# EasyEDA Pro project 305-Analogue-Stochastic-Signal-Generators.eprj

# Board PCB2
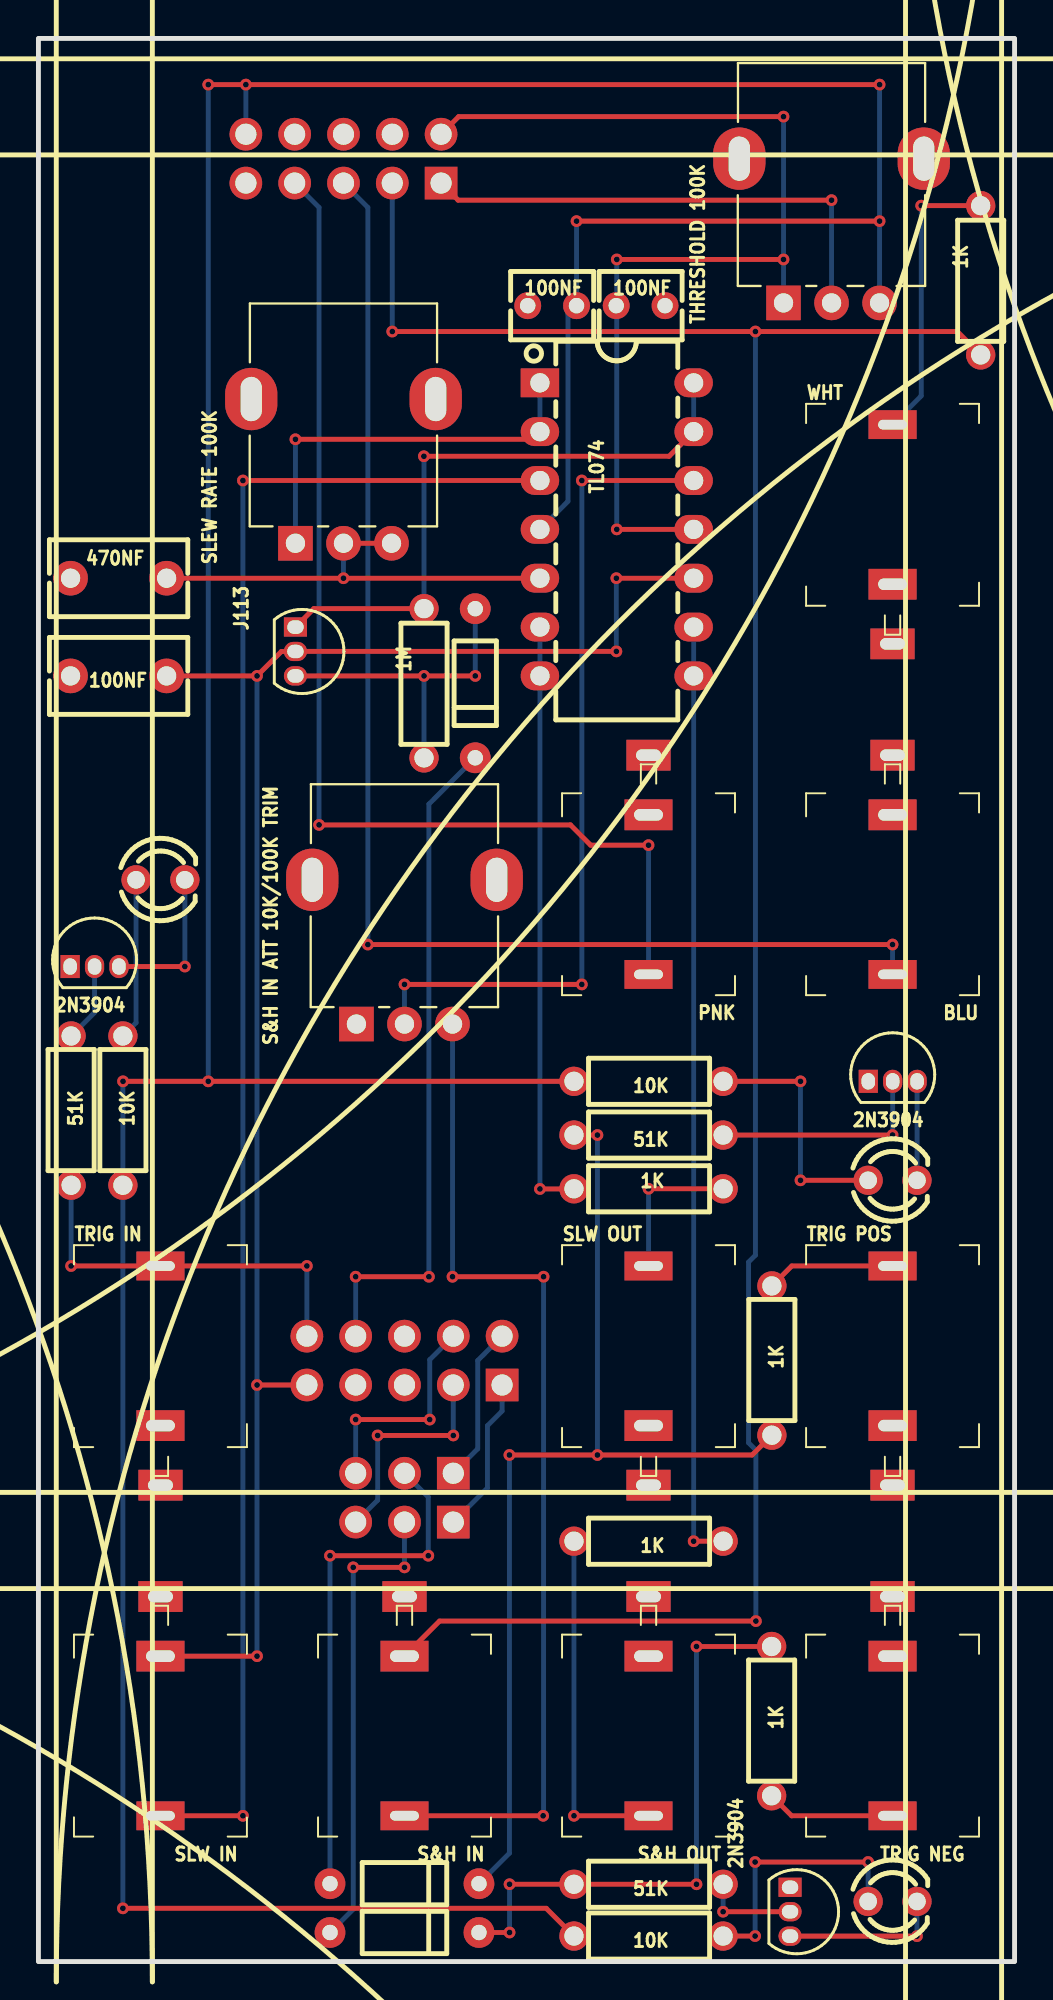
[diagram p0: board, top side]
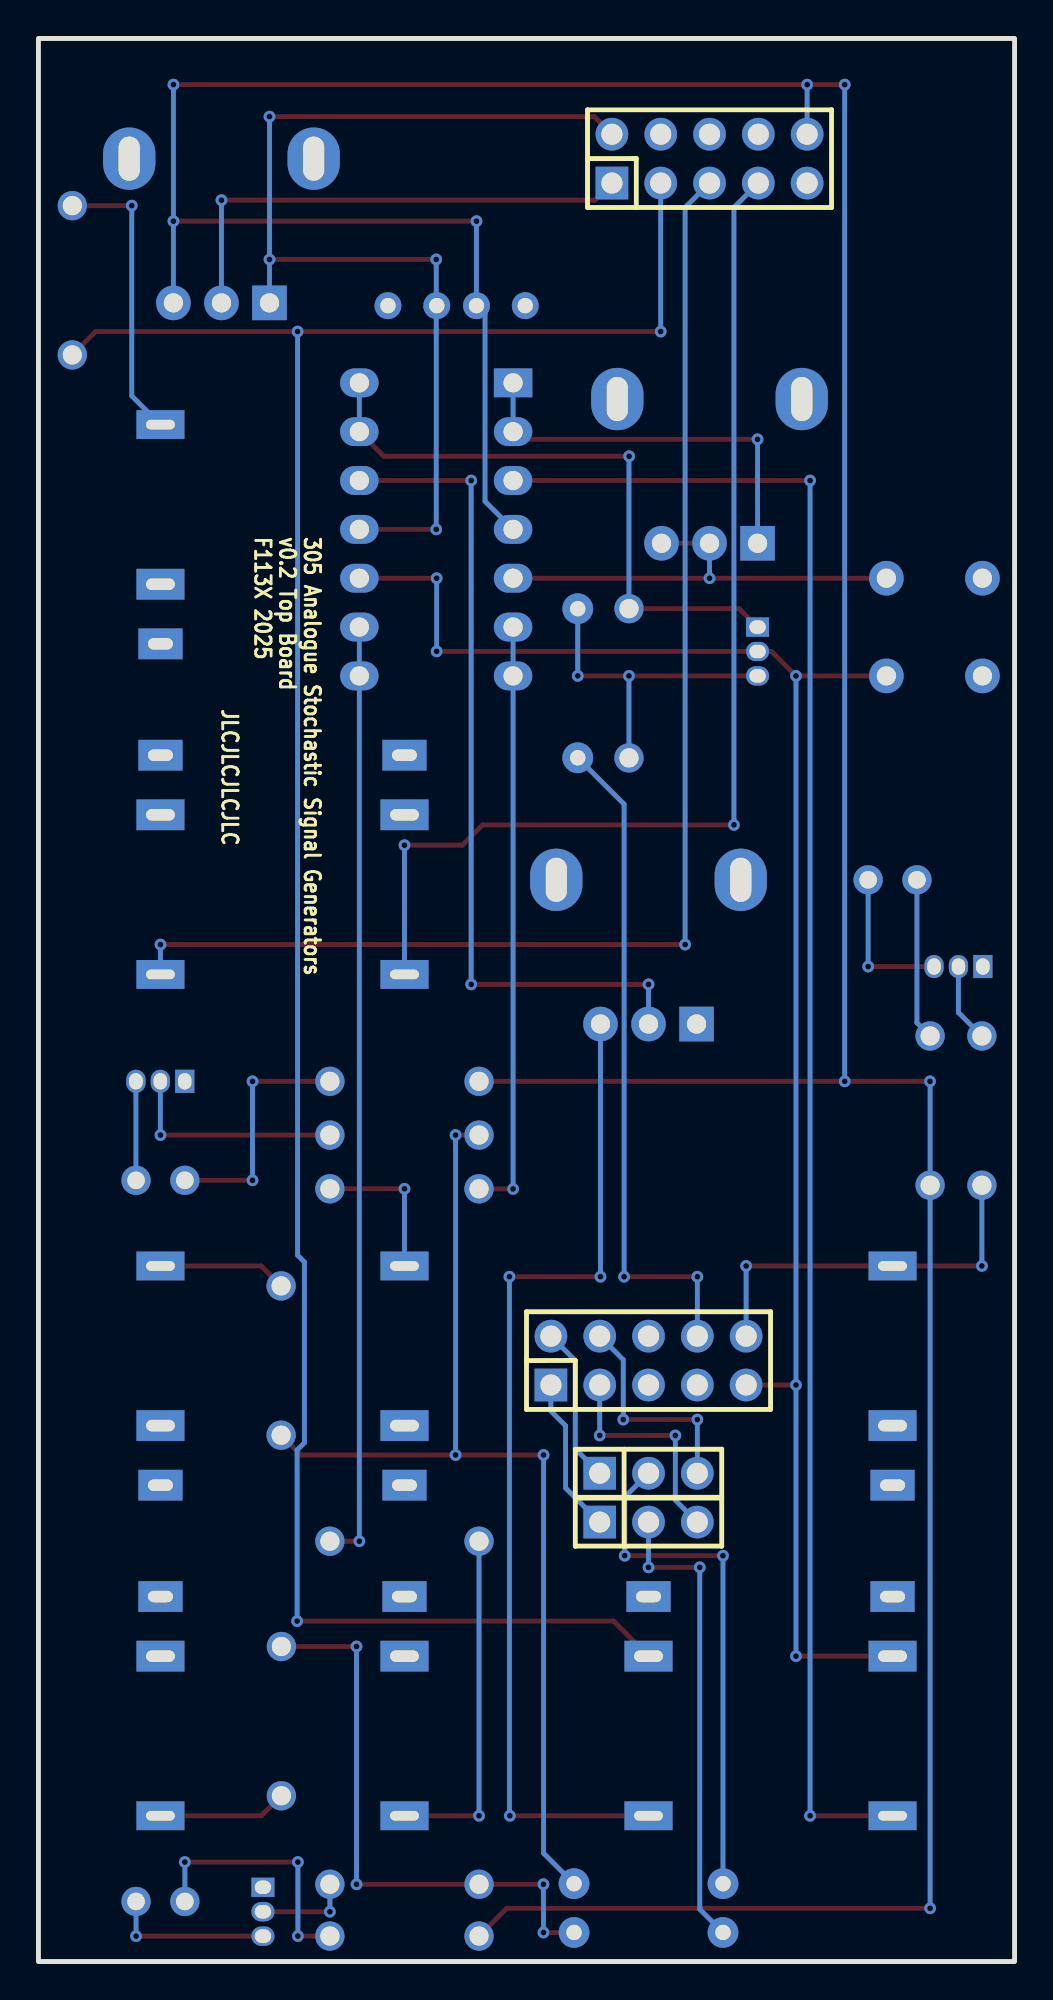
[diagram p1: board, bottom side, seen from below]

Outline 50.8 x 100 mm; copper layers: Top Layer, Bottom Layer. Coordinates in mm from the lower left corner of the outline.
Outline path: rectangle 0,100 50.8,0
Stack: Top Layer 0.035mm / Dielectric1 1.51mm FR4 er 4.5 / Bottom Layer 0.035mm

## Design rules (mm)
template: JLCPCB Capability(Two Layers Board)
spacing copperThickness1oz (default): track to track 0.102, other pairs 0.152 to 0.3
spacing copperThickness2oz: track to track 0.203, other pairs 0.152 to 0.3
track width copperThickness1oz (default): min 0.127, default 0.254, max 2.54
track width copperThickness2oz: min 0.203, default 0.254, max 2.54
differential pair differentialPair (default): width min 0.127, default 0.254, max 2.54; gap min 0.152, default 0.152
via viaSize (default): diameter min 0.5, default 0.61, max 10; hole min 0.3, default 0.305, max 6.3

## Placement (name value [footprint] x y rotation side)
1K  -  [Resistor_Small]  38.16 12.5 90 top
1K#2  -  [Resistor_Small]  49.04 87.43 270 top
1K#3  -  [Resistor_Small]  31.75 21.86 0 top
1K#4  -  [Resistor_Small]  38.17 31.25 90 top
1K#5  -  [Resistor_Small]  31.75 40.18 0 top
1M  -  [Resistor_Small]  20.07 66.47 270 top
2N3904  -  [TO-92-3_L4.5-W3.5-P1.27-L]  39.12 2.59 270 top
2N3904#2  -  [TO-92-3_L4.5-W3.5-P1.27-L]  2.92 51.74 0 top
2N3904#3  -  [TO-92-3_L4.5-W3.5-P1.27-L]  44.46 45.77 0 top
10K  -  [Resistor_Small]  31.75 1.32 0 top
10K#2  -  [Resistor_Small]  31.75 45.77 0 top
10K#3  -  [Resistor_Small]  4.39 44.25 90 top
51K  -  [Resistor_Small]  1.7 44.25 90 top
51K#2  -  [Resistor_Small]  31.75 4.02 0 top
51K#3  -  [Resistor_Small]  31.75 42.98 0 top
100NF  -  [CAP-TH_L4.2-W3.5-P2.54-D0.5]  26.73 86.11 0 top
100NF#2  -  [CAP-TH_L4.2-W3.5-P2.54-D0.5]  31.34 86.11 0 top
100NF#3  -  [CAP-TH_L7.2-W4.0-P5.00-D0.5]  4.17 66.85 0 top
470NF  47nF  [CAP-TH_L7.2-W4.0-P5.00-D0.5]  4.17 71.93 0 top
BLU  -  [Connector_Audio_QingPu:Jack_3.5mm_QingPu_WQP-PJ301M-12]  44.45 56.25 180 top
D1  -  [DO-35_BD2.0-L4.2-P8.20-D0.5-RD]  19.05 1.51 180 top
D1#2  -  [DO-35_BD2.0-L4.2-P8.20-D0.5-RD]  19.05 4.05 180 top
D1#3  -  [DO-35_BD2.0-L4.2-P8.20-D0.5-RD]  22.73 66.47 90 top
H1  -  [HDR-TH_3P-P2.54-V-M]  19.05 25.39 180 bottom
H2  -  [HDR-TH_3P-P2.54-V-M]  19.05 22.85 180 bottom
J113  BC558  [TO-92-3_L4.5-W3.5-P1.27-L]  13.38 68.12 270 top
LED1  -  [LED-TH_BD3.0-P2.54-FD]  44.45 40.62 0 top
LED1#2  -  [LED-TH_BD3.0-P2.54-FD]  44.45 3.12 0 top
LED1#3  -  [LED-TH_BD3.0-P2.54-FD]  6.35 56.25 0 top
PNK  -  [Connector_Audio_QingPu:Jack_3.5mm_QingPu_WQP-PJ301M-12]  31.75 56.25 180 top
S&H IN  -  [Connector_Audio_QingPu:Jack_3.5mm_QingPu_WQP-PJ301M-12]  19.05 12.5 180 top
S&H IN ATT 10K/100K TRIM  -  [benjiaomodular:Potentiometer_RV09]  16.55 48.75 90 top
S&H OUT  -  [Connector_Audio_QingPu:Jack_3.5mm_QingPu_WQP-PJ301M-12]  31.75 12.5 180 top
SLEW RATE 100K  -  [benjiaomodular:Potentiometer_RV09]  13.38 73.75 90 top
SLW IN  -  [Connector_Audio_QingPu:Jack_3.5mm_QingPu_WQP-PJ301M-12]  6.35 12.5 180 top
SLW OUT  -  [Connector_Audio_QingPu:Jack_3.5mm_QingPu_WQP-PJ301M-12]  31.75 31.25 0 top
THRESHOLD 100K  -  [benjiaomodular:Potentiometer_RV09]  38.78 86.25 90 top
TL074  TL074CN  [PDIP-14_L19.7-W6.6-P2.54-LS8.3-BL]  30.1 74.47 270 top
TRIG IN  -  [Connector_Audio_QingPu:Jack_3.5mm_QingPu_WQP-PJ301M-12]  6.35 31.25 0 top
TRIG NEG  -  [Connector_Audio_QingPu:Jack_3.5mm_QingPu_WQP-PJ301M-12]  44.45 12.5 180 top
TRIG POS  -  [Connector_Audio_QingPu:Jack_3.5mm_QingPu_WQP-PJ301M-12]  44.45 31.25 0 top
U1  -  [HDR-TH_10P-P2.54-V-M-R2-C5-S2.54]  19.05 31.25 180 bottom
U1#2  -  [HDR-TH_10P-P2.54-V-M-R2-C5-S2.54]  15.88 93.75 180 bottom
WHT  -  [Connector_Audio_QingPu:Jack_3.5mm_QingPu_WQP-PJ301M-12]  44.45 75 0 top

## Footprints (pads in the part's own frame, mm; a bottom-side part is the same pattern mirrored in y, then rotated)
benjiaomodular:Potentiometer_RV09
  rect 1.8x1.8 hole 1: 1(0,0)
  round 1.8 hole 1: 2(0,-2.5) 3(0,-5)
  oval 3.24x2.72 hole 2.3x1.1: 4(7.5,-7.3) 5(7.5,2.3)
CAP-TH_L4.2-W3.5-P2.54-D0.5
  round 1.4 hole 0.8: 1(-1.27,0) 2(1.27,0)
CAP-TH_L7.2-W4.0-P5.00-D0.5
  round 1.8 hole 1: 1(-2.499,0) 2(2.499,0)
Connector_Audio_QingPu:Jack_3.5mm_QingPu_WQP-PJ301M-12
  rect 2.3x1.6 hole 1.3x0.6: S(0,-6.48)
  rect 2.5x1.5 hole 1.5x0.5: T(0,4.92)
  rect 2.5x1.6 hole 1.5x0.6: TN(0,-3.38)
DO-35_BD2.0-L4.2-P8.20-D0.5-RD
  round 1.6 hole 0.8: 1(-3.876,0) 2(3.876,0)
HDR-TH_3P-P2.54-V-M
  rect 1.7x1.7 hole 1.1: 1(-2.54,0)
  round 1.7 hole 1.1: 2(0,0) 3(2.54,0)
HDR-TH_10P-P2.54-V-M-R2-C5-S2.54
  rect 1.7x1.7 hole 1.1: 1(-5.08,-1.27)
  round 1.7 hole 1.1: 2(-5.08,1.27) 3(-2.54,-1.27) 4(-2.54,1.27) 5(0,-1.27) 6(0,1.27) 7(2.54,-1.27) 8(2.54,1.27) 9(5.08,-1.27) 10(5.08,1.27)
LED-TH_BD3.0-P2.54-FD
  round 1.524 hole 0.914: 1(-1.27,0) 2(1.27,0)
PDIP-14_L19.7-W6.6-P2.54-LS8.3-BL
  rect 1.5x2 hole 1: 1(-7.62,-4)
  oval 1.5x2 hole 1: 2(-5.08,-4) 3(-2.54,-4) 4(0,-4) 5(2.54,-4) 6(5.08,-4) 7(7.62,-4) 8(7.62,4) 9(5.08,4) 10(2.54,4) 11(0,4) 12(-2.54,4) 13(-5.08,4) 14(-7.62,4)
Resistor_Small
  round 1.524 hole 1: 1(-3.88,0) 2(3.882,0)
TO-92-3_L4.5-W3.5-P1.27-L
  rect 1x1.2 hole 0.7x0.85: 1(-1.27,0)
  oval 1x1.2 hole 0.7x0.85: 2(0,0) 3(1.27,0)

## Nets
GND: 2N3904.1 2N3904#2.1 2N3904#3.1 100NF.1 100NF#2.2 100NF#3.1 470NF.1 BLU.S PNK.S S&H IN.S S&H IN ATT 10K/100K TRIM.1 S&H OUT.S SLW IN.S SLW OUT.S TRIG IN.S TRIG NEG.S TRIG POS.S U1.5 U1.6 U1.7 U1#2.4 U1#2.6 U1#2.8 U1#2.9 WHT.S
+12: 10K.1 10K#2.1 10K#3.1 100NF.2 THRESHOLD 100K.3 TL074.4 U1#2.10
-12: 100NF#2.1 THRESHOLD 100K.1 TL074.11 U1#2.2
BLU: BLU.T U1#2.5
CV-IN: S&H IN ATT 10K/100K TRIM.2 TL074.12
DIOD+: 1K#4.1 51K#3.1 D1#2.1
DIOD-: 1K.2 51K#2.1 D1.1
GATE+: H1.3 U1.4
GATE-: H2.3 U1.3
JFET-1: 1M.1 J113.1 TL074.13 TL074.14
JFET-2: 1M.2 D1#3.2 J113.3
JFET-BACK: D1#3.1 U1.8
LED1+: 10K#2.2 LED1.1
LED1-: 2N3904#3.3 LED1.2
LED2+: 10K.2 LED1#2.1
LED2-: 2N3904.3 LED1#2.2
LED3+: 10K#3.2 LED1#3.1
LED3-: 2N3904#2.3 LED1#3.2
MID1: 2N3904#3.2 51K#3.2
MID2: 2N3904.2 51K#2.2
MID3: 2N3904#2.2 51K.2
OUT+: D1#2.2 H1.2
OUT-: D1.2 H2.2
PNK: PNK.T U1#2.7
S&H: 1K#3.2 TL074.8 TL074.9
S&H-IN: S&H IN.T S&H IN ATT 10K/100K TRIM.3
S&H-OUT: 1K#3.1 S&H OUT.T
S&H-PRE: 100NF#3.2 J113.2 SLW IN.TN TL074.10 U1.9
SLW: 1K#5.1 TL074.6 TL074.7
SLW-1: SLEW RATE 100K.1 TL074.1 TL074.2
SLW-23: 470NF.2 SLEW RATE 100K.2 SLEW RATE 100K.3 TL074.5
SLW-IN: SLW IN.T TL074.3
SLW-OUT: 1K#5.2 SLW OUT.T
THRESH: THRESHOLD 100K.2 U1#2.1
TRIG: 51K.1 TRIG IN.T U1.10
TRIG+: H1.1 U1.2
TRIG-: H2.1 U1.1
TRIG-NEG: 1K.1 TRIG NEG.T
TRIG-POS: 1K#4.2 TRIG POS.T
WHT: 1K#2.2 S&H IN.TN U1#2.3
WHT-OUT: 1K#2.1 WHT.T

Pads without a net: BLU TN; PNK TN; S&H IN ATT 10K/100K TRIM 4 5; S&H OUT TN; SLEW RATE 100K 4 5; SLW OUT TN; THRESHOLD 100K 4 5; TRIG IN TN; TRIG NEG TN; TRIG POS TN; WHT TN

## Via types
v1: diameter 0.61, hole 0.305, Top Layer to Bottom Layer, 71 vias

## Routing (per net, layer and track width the routed paths; a pad name or vN(x,y) marks a point on that pad's centre or on a via; arc(x,y) is an arc through that point)
+12: length 223.8
  Top Layer w0.254: 10K#2.1 v1(8.84,45.77) v1(4.4,45.77) ; v1(8.84,97.6) v1(10.79,97.6) v1(43.78,97.6) ; v1(28,90.5) v1(43.78,90.5) ; v1(4.39,2.77) 26.43,2.77 10K.1
  Bottom Layer w0.254: v1(8.84,45.77) v1(8.84,97.6) ; v1(4.4,45.77) 4.39,45.76 10K#3.1 v1(4.39,2.77) ; THRESHOLD 100K.3 v1(43.78,90.5) v1(43.78,97.6) ; v1(28,90.5) 100NF.2 27.56,85.66 27.56,75.93 TL074.4 ; U1#2.10 v1(10.79,97.6)
-12: length 54.6
  Top Layer w0.254: v1(30.1,74.47) TL074.11 ; v1(38.78,88.51) v1(30.1,88.51) ; v1(38.78,95.94) 21.87,95.94 U1#2.2
  Bottom Layer w0.254: v1(30.1,74.47) 30.1,86.08 100NF#2.1 30.1,86.13 v1(30.1,88.51) ; THRESHOLD 100K.1 v1(38.78,88.51) v1(38.78,95.94)
BLU: length 69
  Top Layer w0.254: v1(17.15,52.88) v1(44.45,52.88)
  Bottom Layer w0.254: v1(44.45,52.88) BLU.T ; U1#2.5 17.15,91.21 v1(17.15,52.88)
CV-IN: length 43.3
  Top Layer w0.254: v1(19.05,50.81) v1(28.28,50.81) ; v1(28.28,77.01) TL074.12
  Bottom Layer w0.254: v1(28.28,77.01) v1(28.28,50.81) ; v1(19.05,50.81) S&H IN ATT 10K/100K TRIM.2
DIOD+: length 54.9
  Top Layer w0.254: v1(24.51,26.34) v1(29.09,26.34) 37.14,26.34 1K#4.1 ; v1(29.09,42.98) 51K#3.1
  Bottom Layer w0.254: D1#2.1 24.51,5.63 v1(24.51,26.34) ; v1(29.09,42.98) v1(29.09,26.34)
DIOD-: length 30.1
  Top Layer w0.254: D1.1 v1(24.52,1.51) ; v1(34.25,16.38) 1K.2 ; v1(24.52,4.02) 51K#2.1 v1(34.25,4.02)
  Bottom Layer w0.254: v1(24.52,1.51) v1(24.52,4.02) ; v1(34.25,4.02) v1(34.25,16.38)
GATE+: length 11.5
  Top Layer w0.254: v1(16.51,28.18) v1(20.36,28.18)
  Bottom Layer w0.254: v1(20.36,28.18) 20.36,31.29 U1.4 ; v1(16.51,28.18) H1.3
GATE-: length 11.5
  Top Layer w0.254: v1(17.65,27.36) v1(21.59,27.36)
  Bottom Layer w0.254: H2.3 17.65,23.99 v1(17.65,27.36) ; v1(21.59,27.36) U1.3
JFET-1: length 32.1
  Top Layer w0.254: 1M.1 14.33,70.35 J113.1 ; v1(20.06,78.27) 32.82,78.27 TL074.13
  Bottom Layer w0.254: TL074.13 TL074.14 ; v1(20.06,78.27) 20.07,78.27 1M.1
JFET-2: length 17.1
  Top Layer w0.254: 13.38,66.85 v1(20.07,66.85) v1(22.73,66.85)
  Bottom Layer w0.254: v1(22.73,66.85) D1#3.2 ; v1(20.07,66.85) 1M.2
JFET-BACK: length 34.9
  Top Layer w0.254: v1(16.51,35.61) v1(20.32,35.61)
  Bottom Layer w0.254: v1(20.32,35.61) 20.32,60.18 D1#3.1 ; U1.8 v1(16.51,35.61)
LED1+: length 12.7
  Top Layer w0.254: v1(39.66,45.77) 10K#2.2 ; v1(39.66,40.62) LED1.1
  Bottom Layer w0.254: v1(39.66,40.62) v1(39.66,45.77)
LED1-: length 5.1
  Bottom Layer w0.254: 2N3904#3.3 45.73,40.63 LED1.2
LED2+: length 13.4
  Top Layer w0.254: v1(43.18,5.17) v1(37.3,5.17) ; v1(37.3,1.32) 10K.2
  Bottom Layer w0.254: v1(37.3,1.32) v1(37.3,5.17) ; v1(43.18,5.17) LED1#2.1
LED2-: length 8.4
  Top Layer w0.254: v1(45.72,1.32) 2N3904.3
  Bottom Layer w0.254: LED1#2.2 v1(45.72,1.32)
LED3+: length 8.4
  Bottom Layer w0.254: 10K#3.2 5.08,48.81 LED1#3.1
LED3-: length 7.9
  Top Layer w0.254: 2N3904#2.3 v1(7.62,51.74)
  Bottom Layer w0.254: v1(7.62,51.74) LED1#3.2
MID1: length 11.6
  Top Layer w0.254: 51K#3.2 v1(44.45,42.98)
  Bottom Layer w0.254: v1(44.45,42.98) 44.46,42.98 2N3904#3.2
MID2: length 4.9
  Top Layer w0.254: v1(35.63,2.59) 2N3904.2
  Bottom Layer w0.254: v1(35.63,2.59) 51K#2.2
MID3: length 4.1
  Bottom Layer w0.254: 2N3904#2.2 2.92,49.35 51K.2
OUT+: length 27
  Top Layer w0.254: v1(20.29,21.1) v1(15.17,21.1)
  Bottom Layer w0.254: H1.2 20.29,24.15 v1(20.29,21.1) ; D1#2.2 v1(15.17,21.1)
OUT-: length 24.5
  Top Layer w0.254: v1(16.38,20.5) v1(19.05,20.5)
  Bottom Layer w0.254: D1.2 16.38,2.72 v1(16.38,20.5) ; v1(19.05,20.5) H2.2
PNK: length 58.2
  Top Layer w0.254: v1(31.75,58.05) 28.74,58.05 27.69,59.11 v1(14.6,59.11)
  Bottom Layer w0.254: v1(14.6,59.11) 14.6,91.21 U1#2.7 ; v1(31.75,58.05) PNK.T
S&H: length 49.1
  Top Layer w0.254: v1(34.1,21.86) 1K#3.2
  Bottom Layer w0.254: v1(34.1,21.86) TL074.8 TL074.9
S&H-IN: length 53.1
  Top Layer w0.254: S&H IN.T v1(26.27,7.58) ; v1(26.29,35.61) v1(21.55,35.61)
  Bottom Layer w0.254: v1(21.55,35.61) S&H IN ATT 10K/100K TRIM.3 ; v1(26.27,7.58) 26.29,7.6 v1(26.29,35.61)
S&H-OUT: length 18.2
  Top Layer w0.254: v1(27.87,7.58) S&H OUT.T
  Bottom Layer w0.254: v1(27.87,7.58) 1K#3.1
S&H-PRE: length 90.4
  Top Layer w0.254: 100NF#3.2 v1(11.38,66.85) 12.65,68.12 J113.2 13.38,68.13 v1(30.08,68.13) ; v1(30.08,71.93) TL074.10 ; SLW IN.TN v1(11.38,15.88) ; v1(11.38,29.98) U1.9
  Bottom Layer w0.254: v1(11.38,66.85) v1(11.38,29.98) v1(11.38,15.88) ; v1(30.08,68.13) v1(30.08,71.93)
SLW: length 31
  Top Layer w0.254: 1K#5.1 27.86,40.18 v1(26.1,40.18)
  Bottom Layer w0.254: TL074.6 TL074.7 v1(26.1,40.18)
SLW-1: length 20.8
  Top Layer w0.254: v1(13.38,79.16) 25.7,79.16 TL074.2
  Bottom Layer w0.254: v1(13.38,79.16) SLEW RATE 100K.1 ; TL074.1 TL074.2
SLW-23: length 23.7
  Top Layer w0.254: TL074.5 v1(15.88,71.93) 470NF.2 ; SLEW RATE 100K.2 SLEW RATE 100K.3
  Bottom Layer w0.254: v1(15.88,71.93) SLEW RATE 100K.2
SLW-IN: length 89.2
  Top Layer w0.254: SLW IN.T v1(10.64,7.58) ; v1(10.64,77.01) TL074.3
  Bottom Layer w0.254: v1(10.64,77.01) v1(10.64,7.58)
SLW-OUT: length 7.9
  Top Layer w0.254: v1(31.75,40.18) 1K#5.2
  Bottom Layer w0.254: SLW OUT.T v1(31.75,40.18)
THRESH: length 26
  Top Layer w0.254: v1(41.28,91.59) 21.84,91.59 U1#2.1
  Bottom Layer w0.254: v1(41.28,91.59) THRESHOLD 100K.2
TRIG: length 20.1
  Top Layer w0.254: v1(1.7,36.17) TRIG IN.T v1(13.97,36.17)
  Bottom Layer w0.254: v1(1.7,36.17) 51K.1 ; v1(13.97,36.17) U1.10
TRIG+: length 8.2
  Bottom Layer w0.254: U1.2 22.86,31.25 22.86,26.66 H1.1
TRIG-: length 8.2
  Bottom Layer w0.254: U1.1 24.13,28.63 23.37,27.86 23.37,24.63 H2.1
TRIG-NEG: length 6.7
  Top Layer w0.254: TRIG NEG.T 39.2,7.58 1K.1
TRIG-POS: length 6.7
  Top Layer w0.254: TRIG POS.T 39.21,36.17 1K#4.2
WHT: length 125.3
  Top Layer w0.254: v1(37.34,17.7) 20.87,17.7 S&H IN.TN ; 1K#2.2 47.82,84.76 v1(37.31,84.76) v1(18.41,84.76)
  Bottom Layer w0.254: v1(37.31,84.76) 37.31,36.73 36.96,36.37 36.96,26.97 37.34,26.59 v1(37.34,17.7) ; v1(18.41,84.76) U1#2.3
WHT-OUT: length 15.1
  Top Layer w0.254: v1(45.94,91.31) 1K#2.1
  Bottom Layer w0.254: WHT.T 45.94,81.41 v1(45.94,91.31)

## Copper pours and planes (outline as drawn; the poured copper is in the pictures)
GND on Top Layer: 0,100 50.8,100 50.8,0 0,0
GND on Bottom Layer: 0,100 50.8,100 50.8,0 0,0

## Text on the board
Bottom Silkscreen Layer: 305 Analogue Stochastic Signal Generators / v0.2 Top Board / F113X 2025 | JLCJLCJLCJLC

# Board PCB1
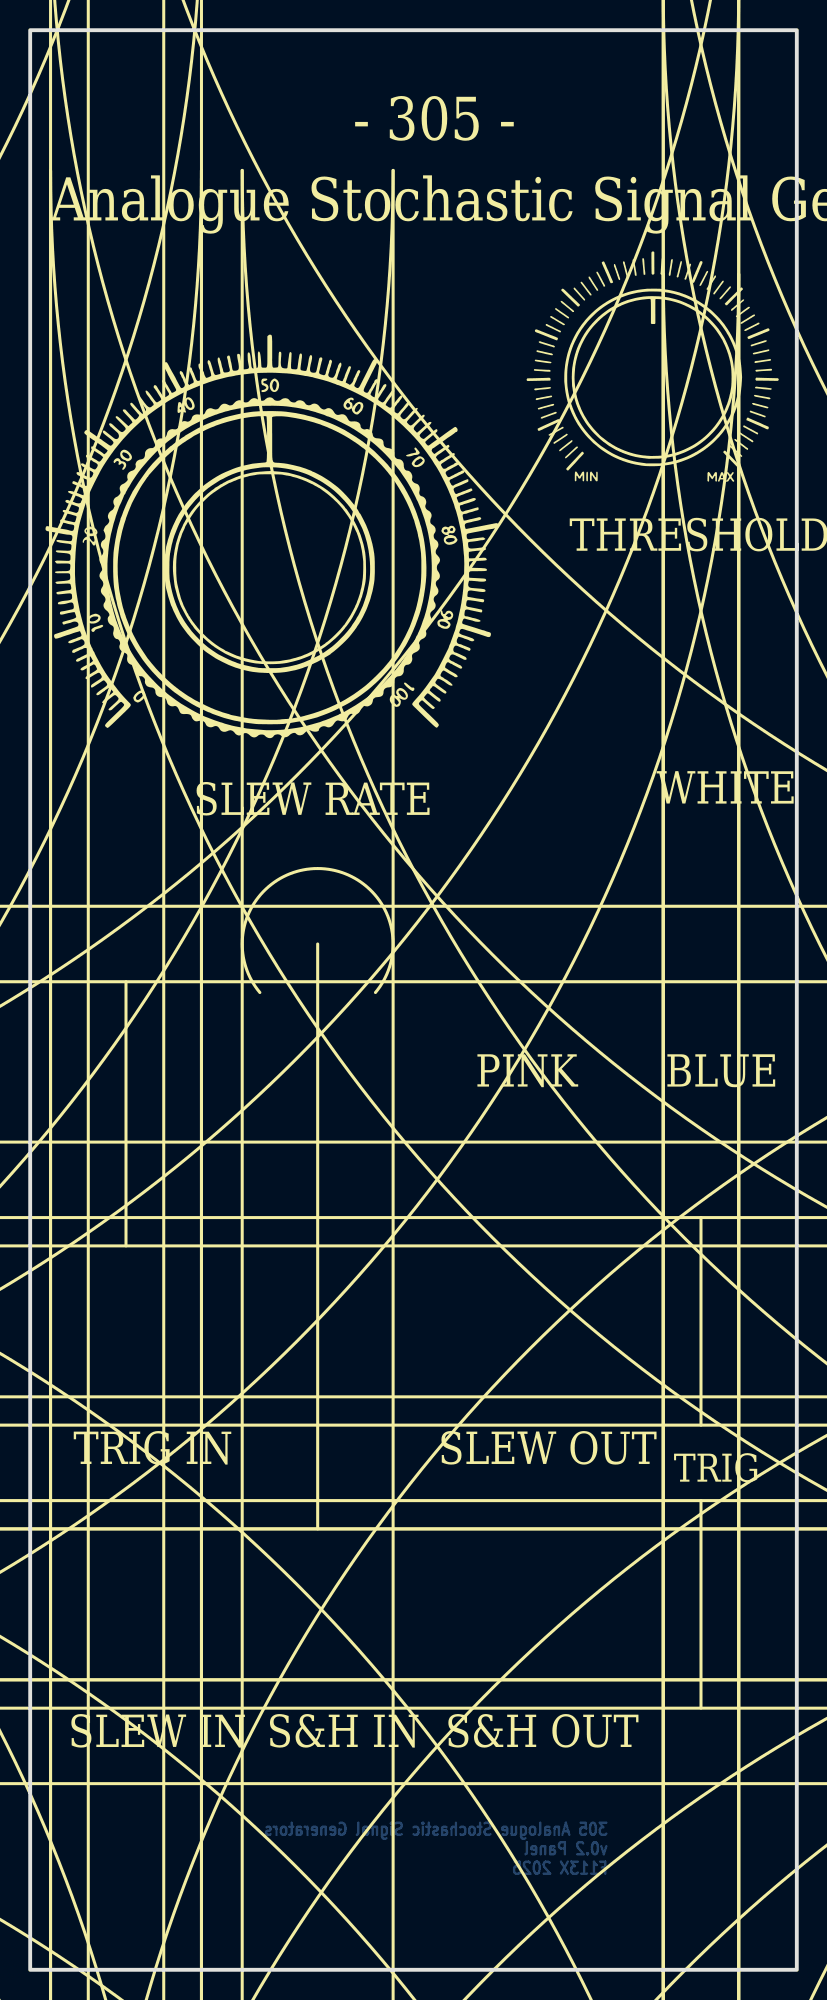
[diagram p2: board, top side]
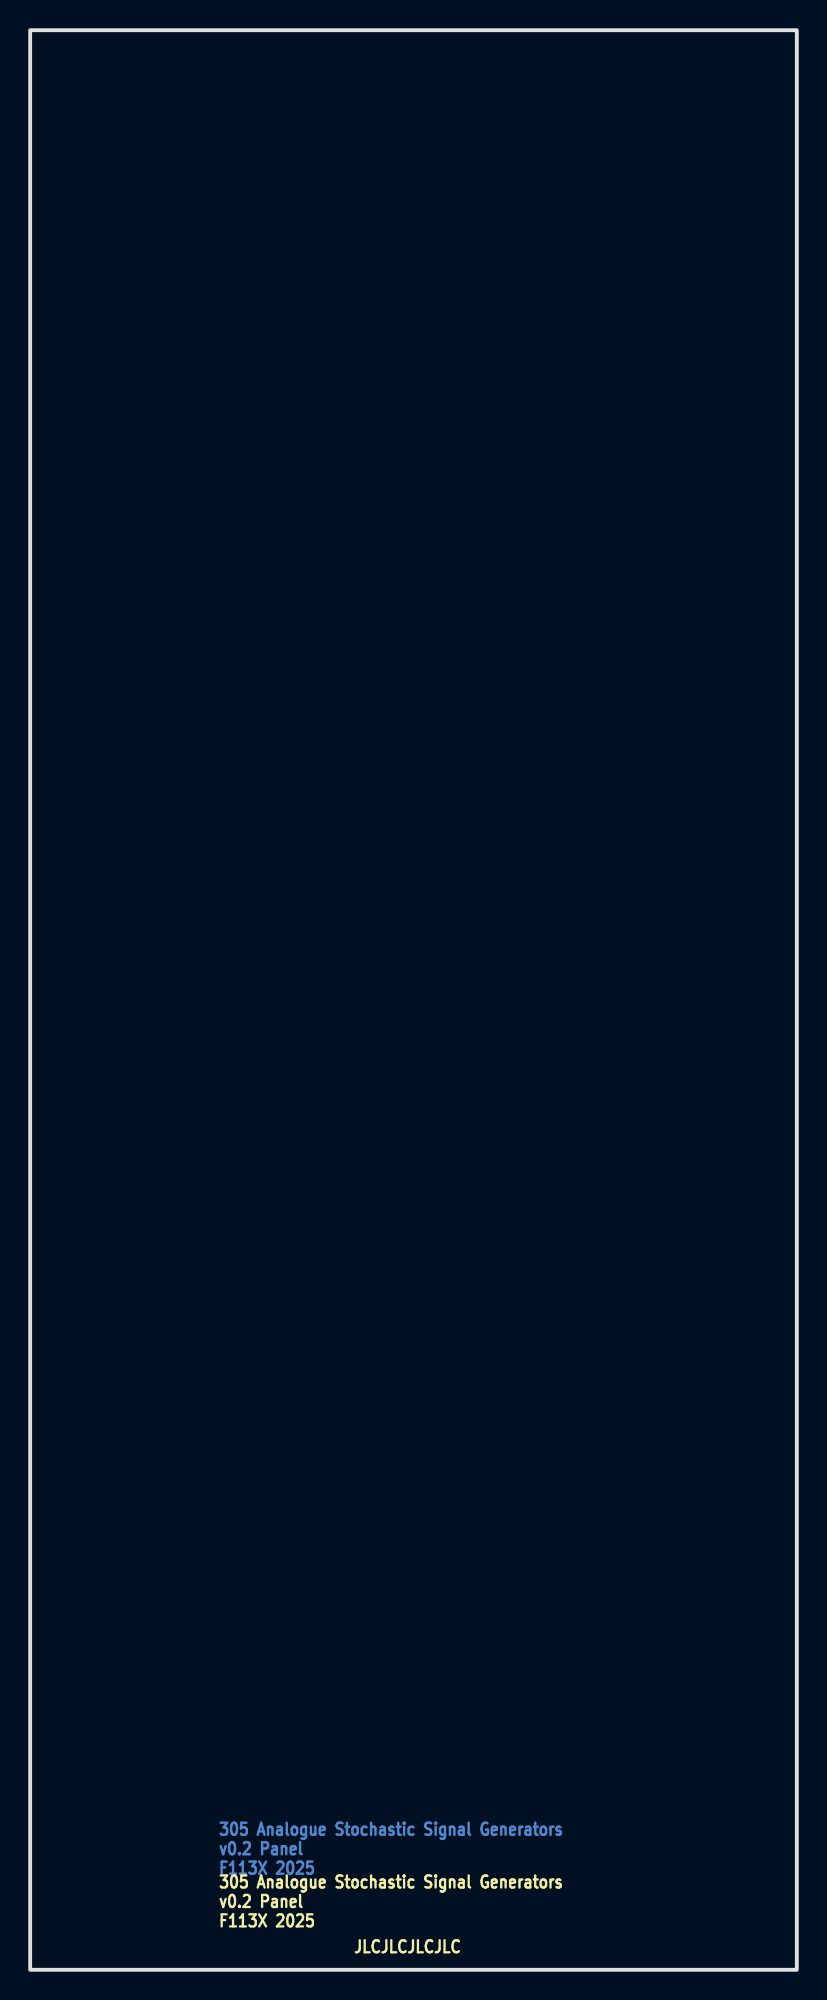
[diagram p3: board, bottom side, seen from below]

Outline 50.8 x 128.5 mm; copper layers: Top Layer, Bottom Layer. Coordinates in mm from the lower left corner of the outline.
Outline path: rectangle 0,128.5 50.8,0
Stack: Top Layer 0.035mm / Dielectric1 1.51mm FR4 er 4.5 / Bottom Layer 0.035mm

## Design rules (mm)
template: JLCPCB Capability(Two Layers Board)
spacing copperThickness1oz (default): track to track 0.102, other pairs 0.152 to 0.3
spacing copperThickness2oz: track to track 0.203, other pairs 0.152 to 0.3
track width copperThickness1oz (default): min 0.127, default 0.254, max 2.54
track width copperThickness2oz: min 0.203, default 0.254, max 2.54
differential pair differentialPair (default): width min 0.127, default 0.254, max 2.54; gap min 0.152, default 0.152
via viaSize (default): diameter min 0.5, default 0.61, max 10; hole min 0.3, default 0.305, max 6.3

## Placement (name value [footprint] x y rotation side)

## Nets

## Text on the board
Bottom Layer: 305 Analogue Stochastic Signal Generators / v0.2 Panel / F113X 2025
Bottom Silkscreen Layer: JLCJLCJLCJLC | 305 Analogue Stochastic Signal Generators / v0.2 Panel / F113X 2025
Top Silkscreen Layer: TRIG | SLEW IN | TRIG IN | SLEW RATE | S&H IN | SLEW OUT | S&H OUT | PINK | THRESHOLD | WHITE | BLUE | Analogue Stochastic Signal Generators | - 305 -

# Board PCB3
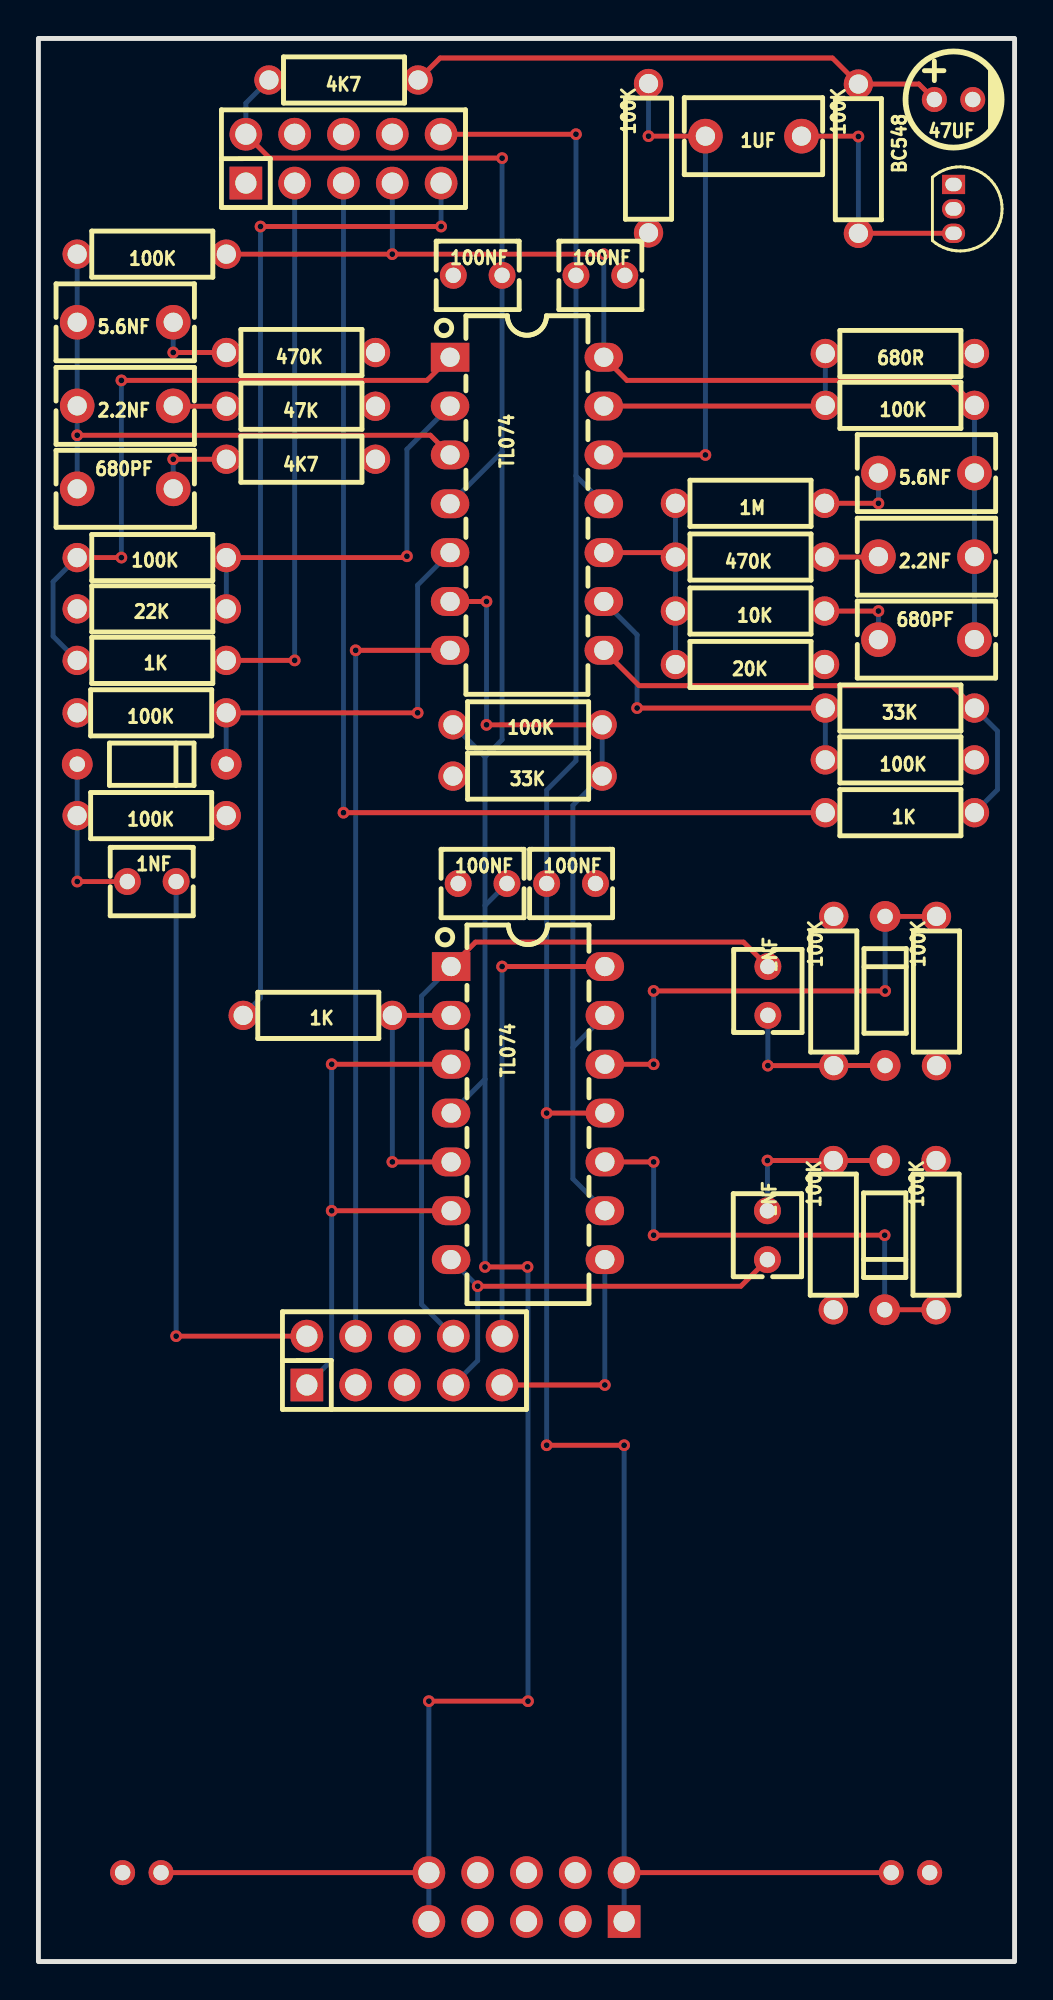
[diagram p4: board, top side]
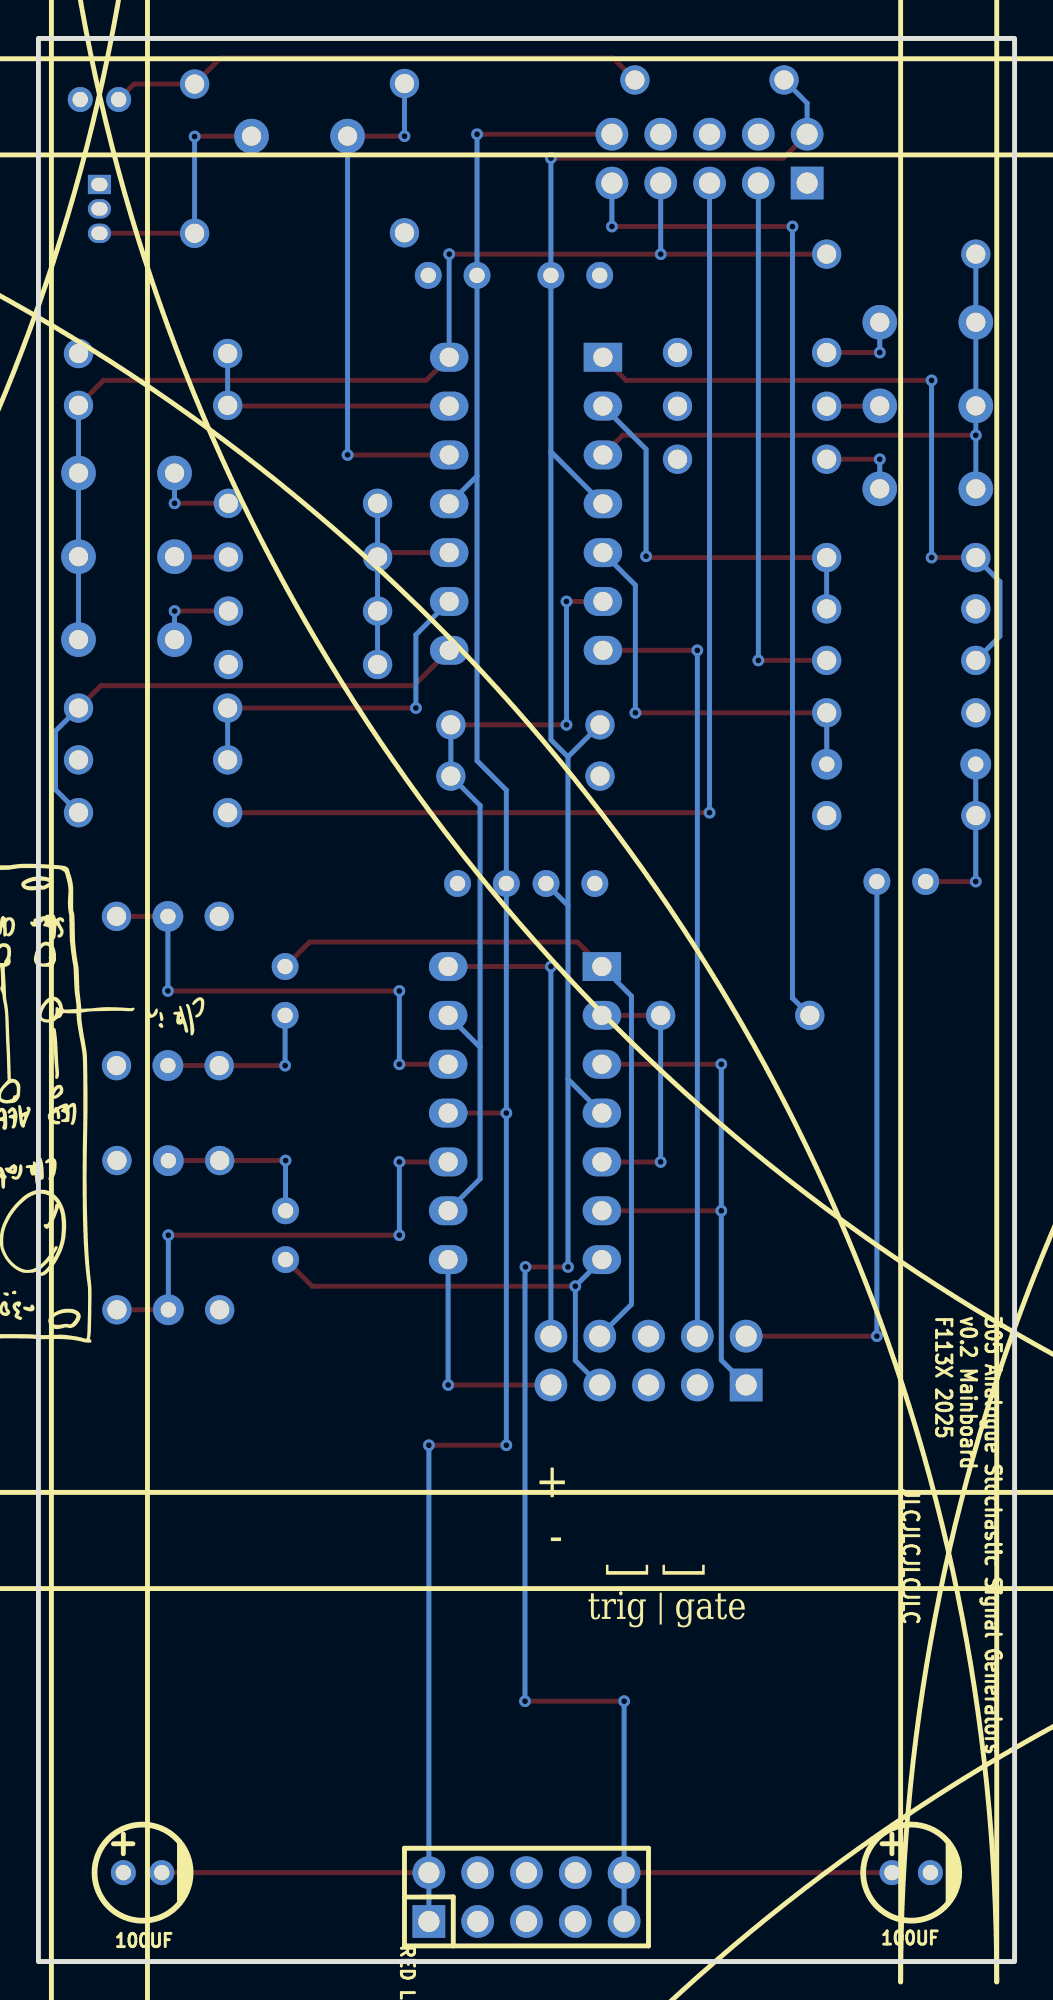
[diagram p5: board, bottom side, seen from below]

Outline 50.8 x 100 mm; copper layers: Top Layer, Bottom Layer. Coordinates in mm from the lower left corner of the outline.
Outline path: rectangle 0,100 50.8,0
Stack: Top Layer 0.035mm / Dielectric1 1.51mm FR4 er 4.5 / Bottom Layer 0.035mm

## Design rules (mm)
template: JLCPCB Capability(Two Layers Board)
spacing copperThickness1oz (default): track to track 0.102, other pairs 0.152 to 0.3
spacing copperThickness2oz: track to track 0.203, other pairs 0.152 to 0.3
track width copperThickness1oz (default): min 0.127, default 0.254, max 2.54
track width copperThickness2oz: min 0.203, default 0.254, max 2.54
differential pair differentialPair (default): width min 0.127, default 0.254, max 2.54; gap min 0.152, default 0.152
via viaSize (default): diameter min 0.5, default 0.61, max 10; hole min 0.3, default 0.305, max 6.3

## Placement (name value [footprint] x y rotation side)
1K  -  [Resistor_Small]  44.83 59.74 0 top
1K#2  -  [Resistor_Small]  5.9 67.66 0 top
1K#3  -  [Resistor_Small]  14.54 49.2 0 top
1M  -  [Resistor_Small]  37.03 75.83 0 top
1NF  -  [CAP-TH_L4.2-W3.5-P2.54-D0.5]  5.9 56.16 0 top
1NF#2  -  [CAP-TH_L4.2-W3.5-P2.54-D0.5]  37.94 37.77 270 top
1NF#3  -  [CAP-TH_L4.2-W3.5-P2.54-D0.5]  37.96 50.47 90 top
1UF  47nF  [CAP-TH_L7.2-W4.0-P5.00-D0.5]  37.21 94.92 0 top
2.2NF  -  [CAP-TH_L7.2-W4.0-P5.00-D0.5]  46.21 73.05 0 top
2.2NF#2  -  [CAP-TH_L7.2-W4.0-P5.00-D0.5]  4.52 80.89 0 top
4K7  -  [Resistor_Small]  15.88 97.84 0 top
4K7#2  -  [Resistor_Small]  13.66 78.12 0 top
5.6NF  -  [CAP-TH_L7.2-W4.0-P5.00-D0.5]  46.21 77.4 0 top
5.6NF#2  -  [CAP-TH_L7.2-W4.0-P5.00-D0.5]  4.52 85.24 0 top
10K  -  [Resistor_Small]  37.03 70.23 0 top
20K  -  [Resistor_Small]  37.03 67.45 0 top
22K  -  [Resistor_Small]  5.9 70.34 0 top
33K  -  [Resistor_Small]  44.83 65.18 0 top
33K#2  -  [Resistor_Small]  25.45 61.64 0 top
47K  -  [Resistor_Small]  13.66 80.88 0 top
47UF  10uF  [CAP-TH_BD5.0-P2.00-D0.8-FD]  47.62 96.83 0 top
100K  -  [Resistor_Small]  44.83 62.49 0 top
100K#2  -  [Resistor_Small]  5.9 88.78 0 top
100K#3  -  [Resistor_Small]  42.67 93.75 270 top
100K#4  -  [Resistor_Small]  5.9 73.01 0 top
100K#5  -  [Resistor_Small]  25.45 64.31 0 top
100K#6  -  [Resistor_Small]  31.75 93.78 270 top
100K#7  -  [Resistor_Small]  5.9 64.93 180 top
100K#8  -  [Resistor_Small]  5.9 59.59 180 top
100K#9  -  [Resistor_Small]  41.37 37.77 90 top
100K#10  -  [Resistor_Small]  46.71 37.77 90 top
100K#11  -  [Resistor_Small]  46.74 50.47 270 top
100K#12  -  [Resistor_Small]  41.39 50.47 270 top
100K#13  -  [Resistor_Small]  44.83 80.92 0 top
100NF  -  [CAP-TH_L4.2-W3.5-P2.54-D0.5]  29.24 87.68 0 top
100NF#2  -  [CAP-TH_L4.2-W3.5-P2.54-D0.5]  22.86 87.68 0 top
100NF#3  -  [CAP-TH_L4.2-W3.5-P2.54-D0.5]  27.72 56.06 0 top
100NF#4  -  [CAP-TH_L4.2-W3.5-P2.54-D0.5]  23.11 56.06 0 top
100UF  -  [CAP-TH_BD5.0-P2.00-D0.8-FD]  5.38 4.62 180 bottom
100UF#2  -  [CAP-TH_BD5.0-P2.00-D0.8-FD]  45.38 4.62 180 bottom
470K  -  [Resistor_Small]  37.03 73.03 0 top
470K#2  -  [Resistor_Small]  13.66 83.67 0 top
680PF  -  [CAP-TH_L7.2-W4.0-P5.00-D0.5]  46.21 68.74 0 top
680PF#2  -  [CAP-TH_L7.2-W4.0-P5.00-D0.5]  4.52 76.58 0 top
680R  -  [Resistor_Small]  44.83 83.62 0 top
BC548  BC558  [TO-92-3_L4.5-W3.5-P1.27-L]  47.62 91.14 270 top
D1  -  [DO-35_BD2.0-L4.2-P8.20-D0.5-RD]  5.9 62.26 180 top
D1#2  -  [DO-35_BD2.0-L4.2-P8.20-D0.5-RD]  44.04 37.77 90 top
D1#3  -  [DO-35_BD2.0-L4.2-P8.20-D0.5-RD]  44.06 50.47 270 top
RED LINE  ZX-PZ2.54-2-5PZZ  [HDR-TH_10P-P2.54-V-M-R2-C5-S2.54]  25.4 3.35 180 bottom
TL074  -  [PDIP-14_L19.7-W6.6-P2.54-LS8.3-BL]  25.48 44.12 270 top
TL074#2  -  [PDIP-14_L19.7-W6.6-P2.54-LS8.3-BL]  25.42 75.8 270 top
U1  -  [HDR-TH_10P-P2.54-V-M-R2-C5-S2.54]  15.88 93.75 0 top
U1#2  -  [HDR-TH_10P-P2.54-V-M-R2-C5-S2.54]  19.05 31.25 0 top

## Footprints (pads in the part's own frame, mm; a bottom-side part is the same pattern mirrored in y, then rotated)
CAP-TH_BD5.0-P2.00-D0.8-FD
  round 1.3 hole 0.8: 1(-1,0) 2(1,0)
CAP-TH_L4.2-W3.5-P2.54-D0.5
  round 1.4 hole 0.8: 1(-1.27,0) 2(1.27,0)
CAP-TH_L7.2-W4.0-P5.00-D0.5
  round 1.8 hole 1: 1(-2.499,0) 2(2.499,0)
DO-35_BD2.0-L4.2-P8.20-D0.5-RD
  round 1.6 hole 0.8: 1(-3.876,0) 2(3.876,0)
HDR-TH_10P-P2.54-V-M-R2-C5-S2.54
  rect 1.7x1.7 hole 1.1: 1(-5.08,-1.27)
  round 1.7 hole 1.1: 2(-5.08,1.27) 3(-2.54,-1.27) 4(-2.54,1.27) 5(0,-1.27) 6(0,1.27) 7(2.54,-1.27) 8(2.54,1.27) 9(5.08,-1.27) 10(5.08,1.27)
PDIP-14_L19.7-W6.6-P2.54-LS8.3-BL
  rect 1.5x2 hole 1: 1(-7.62,-4)
  oval 1.5x2 hole 1: 2(-5.08,-4) 3(-2.54,-4) 4(0,-4) 5(2.54,-4) 6(5.08,-4) 7(7.62,-4) 8(7.62,4) 9(5.08,4) 10(2.54,4) 11(0,4) 12(-2.54,4) 13(-5.08,4) 14(-7.62,4)
Resistor_Small
  round 1.524 hole 1: 1(-3.88,0) 2(3.882,0)
TO-92-3_L4.5-W3.5-P1.27-L
  rect 1x1.2 hole 0.7x0.85: 1(-1.27,0)
  oval 1x1.2 hole 0.7x0.85: 2(0,0) 3(1.27,0)

## Nets
3V-REF: 33K#2.2 100K#5.2 TL074.9 TL074.13 TL074#2.6
GND: 4K7#2.2 20K.2 22K.1 33K#2.1 47K.2 47UF.2 100K.2 100K#6.2 100K#7.2 100K#8.1 100K#9.1 100K#10.2 100K#11.2 100K#12.1 100NF.2 100NF#2.1 100NF#3.2 100NF#4.1 100UF.2 100UF#2.1 470K#2.2 680R.2 BC548.2 RED LINE.3 RED LINE.4 RED LINE.5 RED LINE.6 RED LINE.7 RED LINE.8 U1.1 U1.4 U1.6 U1.8 U1#2.3 U1#2.5 U1#2.6
1: 4K7.2 47UF.1 100K#3.1
2: 1UF.1 100K#6.1 TL074#2.12
3: 100K#13.1 680R.1 TL074#2.13
4: 33K.1 100K.1 TL074#2.9
5: 22K.2 100K#4.2 TL074#2.2
+12: 4K7.1 100K#5.1 100NF#2.2 100NF#4.2 100UF.1 RED LINE.9 RED LINE.10 TL074.4 TL074#2.4 U1.2
-12: 100NF.1 100NF#3.1 100UF#2.2 RED LINE.1 RED LINE.2 TL074.11 TL074#2.11 U1.10
BC548-3: 1UF.2 100K#3.2 BC548.3
BLU: 1K.1 U1.5
BLU-1M: 1M.2 5.6NF.1
BLU-10K: 10K.2 680PF.1
BLU-470K: 2.2NF.1 470K.2
BLUE: 1M.1 10K.1 20K.1 470K.1 TL074#2.10
BLUEE: 1K.2 33K.2 TL074#2.8
DIOD+: 1NF.1 100K#8.2 D1.2
DIOD++: 1NF#3.1 100K#12.2 D1#3.2
DIOD+-: 100K#11.1 D1#3.1 TL074.12
DIOD-: 100K#7.1 D1.1 TL074#2.5
DIOD-+: 1NF#2.1 100K#9.2 D1#2.2
DIOD--: 100K#10.1 D1#2.1 TL074.10
GATE+: 1NF#3.2 TL074.1 U1#2.8
GATE-: 1NF#2.2 TL074.7 U1#2.7
JFET-BACK: TL074#2.7 U1#2.4
NC: BC548.1
PIINK: 1K#2.1 100K#4.1 TL074#2.1
PINK: 2.2NF#2.1 5.6NF#2.1 100K#2.1 680PF#2.1 TL074#2.3
PINK-4K7: 4K7#2.1 680PF#2.2
PINK-47K: 2.2NF#2.2 47K.1
PINK-470K: 5.6NF#2.2 470K#2.1
PNK: 1K#2.2 U1.3
S&H-PRE: TL074.3 TL074.6 U1#2.1
THRESH: 1K#3.1 U1.9
THRESHOLD: 1K#3.2 TL074.2 TL074.5
TRIG: 1NF.2 U1#2.2
TRIG+: TL074.14 U1#2.10
TRIG-: TL074.8 U1#2.9
WHT: 2.2NF.2 5.6NF.2 100K#2.2 100K#13.2 680PF.2 TL074#2.14 U1.7

## Via types
v1: diameter 0.61, hole 0.305, Top Layer to Bottom Layer, 47 vias

## Routing (per net, layer and track width the routed paths; a pad name or vN(x,y) marks a point on that pad's centre or on a via; arc(x,y) is an arc through that point)
3V-REF: length 43.3
  Top Layer w0.254: v1(23.32,64.31) 100K#5.2 ; v1(23.32,70.72) TL074#2.6
  Bottom Layer w0.254: 27.81,47.54 27.81,40.7 TL074.9 ; 27.81,47.54 TL074.13 ; 27.81,47.54 27.81,60.12 33K#2.2 100K#5.2 ; v1(23.32,70.72) v1(23.32,64.31)
1: length 28.2
  Top Layer w0.254: 4K7.2 20.9,98.98 41.32,98.98 100K#3.1 45.82,97.63 47UF.1
2: length 27.6
  Top Layer w0.254: v1(31.75,94.92) 1UF.1 ; TL074#2.12 v1(34.71,78.34)
  Bottom Layer w0.254: v1(34.71,78.34) 1UF.1 ; v1(31.75,94.92) 100K#6.1
3: length 14.2
  Top Layer w0.254: 100K#13.1 40.91,80.88 TL074#2.13
  Bottom Layer w0.254: 100K#13.1 680R.1
4: length 18.8
  Top Layer w0.254: 33K.1 v1(31.16,65.18)
  Bottom Layer w0.254: 100K.1 33K.1 ; v1(31.16,65.18) 31.16,68.99 TL074#2.9
5: length 20.8
  Top Layer w0.254: 100K#4.2 19.11,73.01 v1(19.18,73.08)
  Bottom Layer w0.254: TL074#2.2 19.18,78.64 v1(19.18,73.08) ; 22K.2 100K#4.2
+12: length 140.8
  Top Layer w0.254: RED LINE.10 100UF.1 ; U1.2 12.04,93.78 v1(24.13,93.78) ; v1(23.24,36.12) v1(25.45,36.12) ; v1(25.48,13.54) v1(20.32,13.54)
  Bottom Layer w0.254: U1.2 10.79,96.64 4K7.1 ; 100K#5.1 23.24,62.64 ; 23.24,62.64 23.24,54.92 ; 23.24,62.64 24.13,63.53 24.13,78.51 ; TL074#2.4 24.13,78.51 ; 24.13,78.51 100NF#2.2 v1(24.13,93.78) ; 23.24,45.88 TL074.4 ; 23.24,45.88 v1(23.24,36.12) ; 23.24,45.88 23.24,54.92 ; v1(25.48,13.54) 25.48,36.1 v1(25.45,36.12) ; 23.24,54.92 100NF#4.2 ; RED LINE.9 RED LINE.10 v1(20.32,13.54)
-12: length 123.6
  Top Layer w0.254: v1(26.45,26.85) v1(30.48,26.85) ; RED LINE.2 100UF#2.2 ; v1(26.45,44.12) TL074.11 ; U1.10 v1(27.97,95.02)
  Bottom Layer w0.254: v1(30.48,26.85) RED LINE.2 RED LINE.1 ; v1(27.97,95.02) 100NF.1 27.97,77.25 ; 27.97,77.25 27.97,62.44 26.45,60.92 100NF#3.1 v1(26.45,44.12) v1(26.45,26.85) ; 27.97,77.25 TL074#2.11
BC548-3: length 13
  Top Layer w0.254: 1UF.2 42.65,94.92 v1(42.67,94.9) ; 100K#3.2 BC548.3
  Bottom Layer w0.254: v1(42.67,94.9) 100K#3.2
BLU: length 57.8
  Top Layer w0.254: v1(15.88,59.74) 1K.1
  Bottom Layer w0.254: v1(15.88,59.74) U1.5
BLU-1M: length 4.4
  Top Layer w0.254: v1(43.72,75.83) 1M.2
  Bottom Layer w0.254: v1(43.72,75.83) 43.72,77.4
BLU-10K: length 4.3
  Top Layer w0.254: 10K.2 v1(43.72,70.23)
  Bottom Layer w0.254: v1(43.72,70.23) 43.72,68.74
BLU-470K: length 2.8
  Top Layer w0.254: 470K.2 43.7,73.03 43.72,73.05
BLUE: length 12.2
  Top Layer w0.254: 33.15,73.03 32.92,73.26 29.42,73.26
  Bottom Layer w0.254: 33.15,75.83 33.15,67.45
BLUEE: length 27
  Top Layer w0.254: TL074#2.8 31.26,66.34 47.55,66.34 33K.2
  Bottom Layer w0.254: 33K.2 49.91,63.98 49.91,60.94 1K.2
DIOD+: length 8.7
  Top Layer w0.254: v1(2.02,56.16) 1NF.1
  Bottom Layer w0.254: v1(2.02,56.16) 2.02,59.58 100K#8.2 2.02,59.59 D1.2
DIOD++: length 8.7
  Top Layer w0.254: v1(37.96,46.59) 100K#12.2 41.4,46.59 D1#3.2
  Bottom Layer w0.254: v1(37.96,46.59) 1NF#3.1
DIOD+-: length 24.9
  Top Layer w0.254: v1(32.02,46.66) TL074.12 ; D1#3.1 46.73,54.35 100K#11.1 ; v1(32.02,50.47) v1(44.06,50.47)
  Bottom Layer w0.254: v1(32.02,46.66) v1(32.02,50.47) ; v1(44.06,50.47) D1#3.1
DIOD-: length 21.7
  Top Layer w0.254: v1(19.73,64.93) 100K#7.1
  Bottom Layer w0.254: 100K#7.1 9.77,64.93 D1.1 ; v1(19.73,64.93) 19.73,71.58 21.42,73.26
DIOD-+: length 8.7
  Top Layer w0.254: v1(37.94,41.65) 100K#9.2 44.03,41.65 D1#2.2
  Bottom Layer w0.254: 1NF#2.1 v1(37.94,41.65)
DIOD--: length 24.9
  Top Layer w0.254: v1(32.02,41.58) TL074.10 ; D1#2.1 46.71,33.89 100K#10.1 ; v1(32.02,37.77) v1(44.04,37.77)
  Bottom Layer w0.254: v1(32.02,37.77) v1(32.02,41.58) ; v1(44.04,37.77) D1#2.1
GATE+: length 38.1
  Top Layer w0.254: TL074.1 22.75,53.01 36.69,53.01 1NF#3.2
  Bottom Layer w0.254: U1#2.8 19.94,34.17 19.94,50.2 TL074.1
GATE-: length 23.3
  Top Layer w0.254: v1(22.86,35.12) 36.56,35.12 1NF#2.2
  Bottom Layer w0.254: U1#2.7 22.86,31.25 v1(22.86,35.12) TL074.7
JFET-BACK: length 40.6
  Top Layer w0.254: TL074#2.7 v1(16.51,68.18)
  Bottom Layer w0.254: v1(16.51,68.18) U1#2.4
PIINK: length 35.5
  Top Layer w0.254: 100K#4.1 v1(4.32,73.01) ; TL074#2.1 20.22,82.22 v1(4.32,82.22)
  Bottom Layer w0.254: v1(4.32,73.01) v1(4.32,82.22) ; 1K#2.1 0.76,68.91 0.76,71.75 100K#4.1
PINK: length 32
  Top Layer w0.254: v1(2.02,79.37) 20.4,79.37 TL074#2.3
  Bottom Layer w0.254: 680PF#2.1 v1(2.02,79.37) 2.2NF#2.1 5.6NF#2.1 100K#2.1
PINK-4K7: length 4.3
  Top Layer w0.254: v1(7.02,78.12) 4K7#2.1
  Bottom Layer w0.254: v1(7.02,78.12) 680PF#2.2
PINK-47K: length 2.8
  Top Layer w0.254: 2.2NF#2.2 7.03,80.88 47K.1
PINK-470K: length 4.3
  Top Layer w0.254: v1(7.02,83.67) 470K#2.1
  Bottom Layer w0.254: v1(7.02,83.67) 5.6NF#2.2
PNK: length 28.4
  Top Layer w0.254: 1K#2.2 v1(13.34,67.66)
  Bottom Layer w0.254: v1(13.34,67.66) U1.3
S&H-PRE: length 29.6
  Top Layer w0.254: TL074.3 v1(15.26,46.66) ; v1(15.26,39.04) TL074.6
  Bottom Layer w0.254: v1(15.26,46.66) v1(15.26,39.04) 15.26,31.27 U1#2.1
THRESH: length 53.1
  Top Layer w0.254: v1(11.56,90.22) v1(20.96,90.22)
  Bottom Layer w0.254: v1(20.96,90.22) U1.9 ; 10.66,49.2 11.56,50.1 v1(11.56,90.22)
THRESHOLD: length 13.7
  Top Layer w0.254: v1(18.42,41.58) TL074.5 ; 18.42,49.2 TL074.2
  Bottom Layer w0.254: v1(18.42,41.58) 18.42,49.2
TRIG: length 30.4
  Top Layer w0.254: v1(7.17,32.52) U1#2.2
  Bottom Layer w0.254: v1(7.17,32.52) 1NF.2
TRIG+: length 24.6
  Top Layer w0.254: v1(24.13,51.74) TL074.14
  Bottom Layer w0.254: U1#2.10 v1(24.13,51.74)
TRIG-: length 11.9
  Top Layer w0.254: U1#2.9 v1(29.48,29.98)
  Bottom Layer w0.254: v1(29.48,29.98) TL074.8
WHT: length 61.2
  Top Layer w0.254: v1(29.42,88.78) v1(18.41,88.78) 100K#2.2 ; TL074#2.14 30.63,82.22 47.42,82.22 100K#13.2
  Bottom Layer w0.254: 100K#13.2 5.6NF.2 2.2NF.2 680PF.2 ; TL074#2.14 v1(29.42,88.78) ; v1(18.41,88.78) U1.7

## Copper pours and planes (outline as drawn; the poured copper is in the pictures)
GND on Top Layer: 0,100 50.8,100 50.8,0 0,0
GND on Bottom Layer: 0,100 50.8,100 50.8,0 0,0

## Text on the board
Bottom Silkscreen Layer: 305 Analogue Stochastic Signal Generators / v0.2 Mainboard / F113X 2025 | JLCJLCJLCJLC | trig | gate | + / - | [ / [
